# EAGLE design Analog-Mux-Breakout-v11 (EAGLE 6.2)
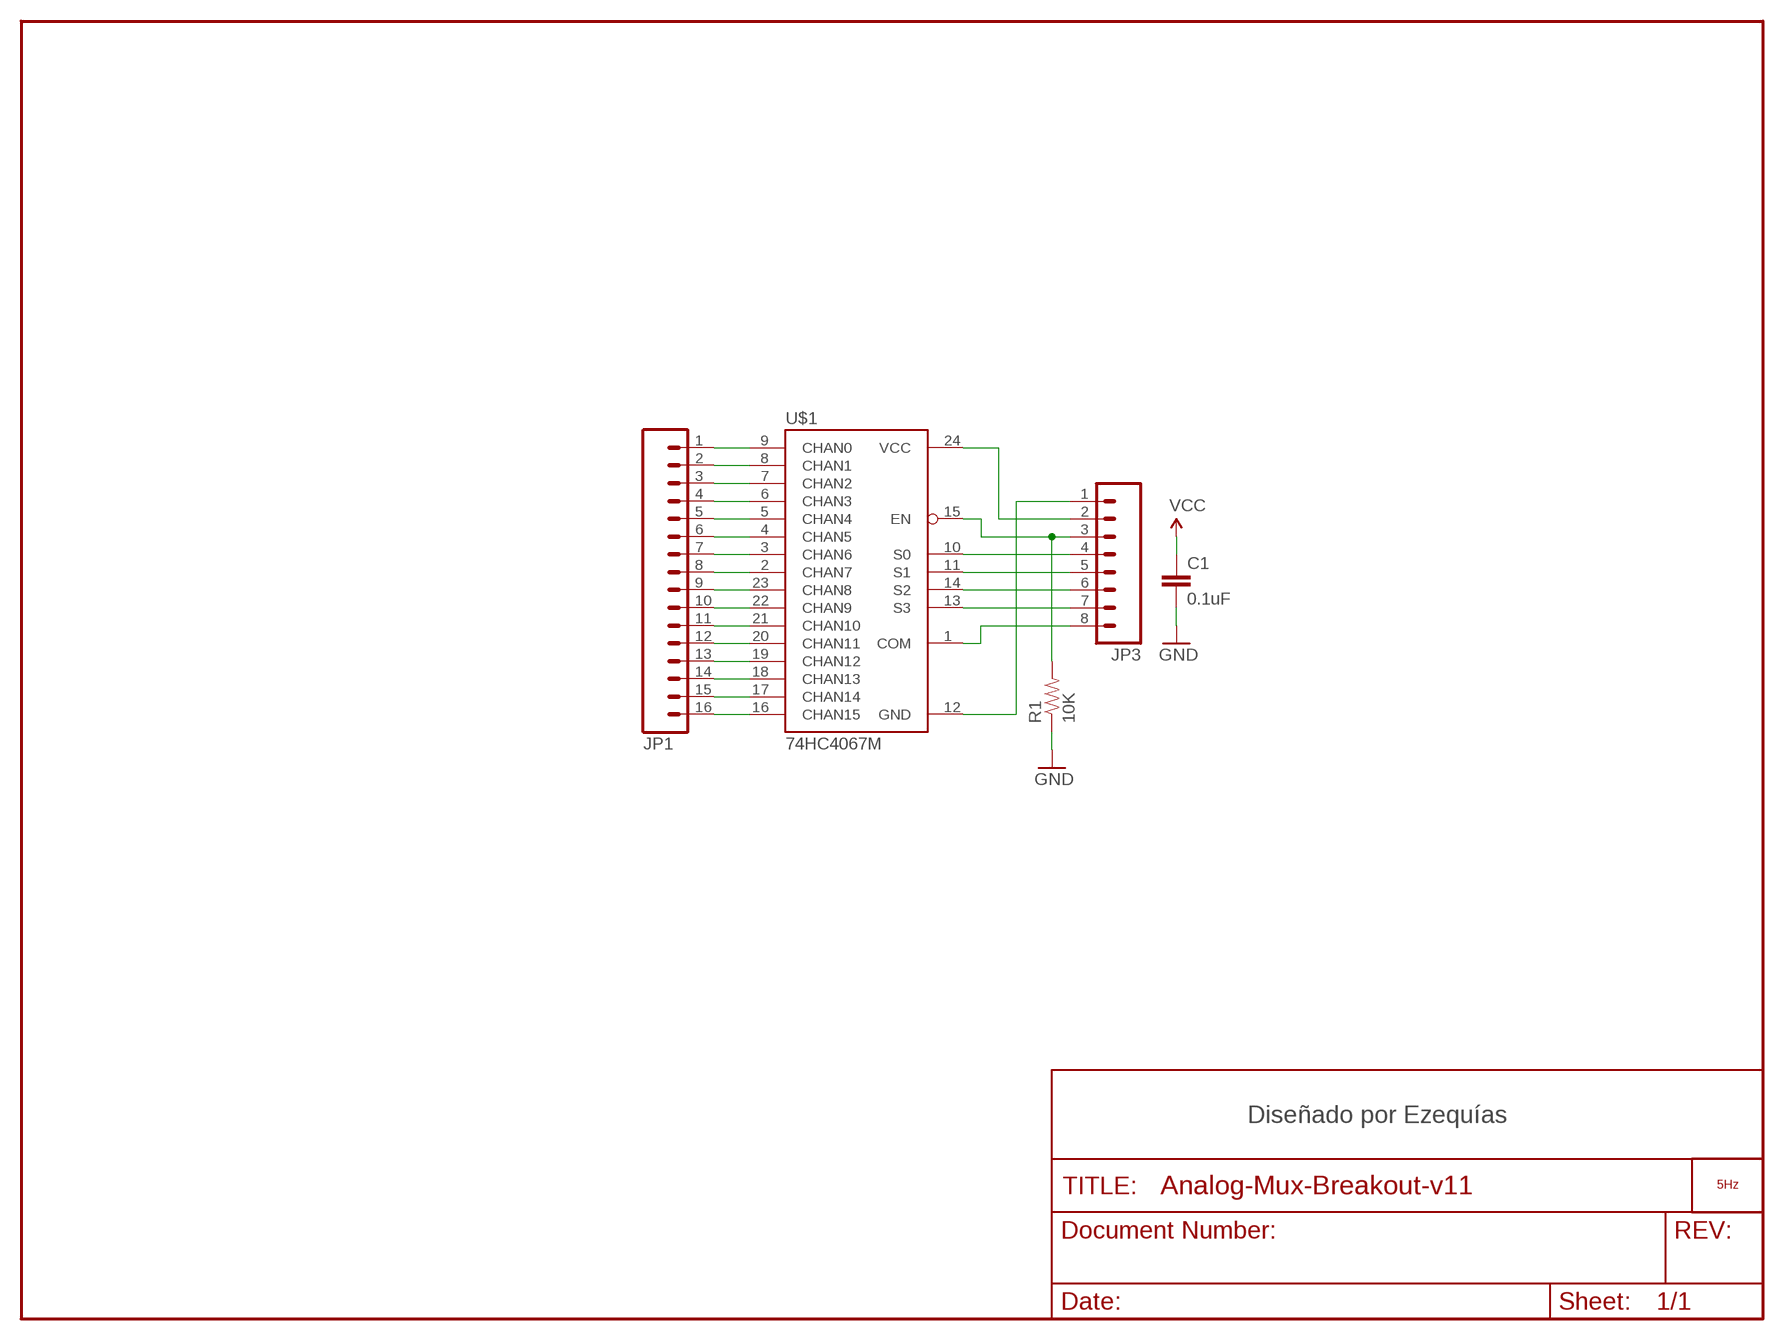
[diagram p0: schematic, sheet 1]

## Parts
C1  0.1uF  CAP0402  [C0402]
JP1  M16PTH  [1X16]
JP3  M08  [1X08]
LOGO1  LOGO_5HZ_H_10MM  [5HZ_LOGO_H_10MM]
R1  10K  RESISTOR0402  [C0402]
U$1  74HC4067M  [SOIC_28]

## Nets
C0: JP1.1 U$1.9(CHAN0)
C1: JP1.2 U$1.8(CHAN1)
C2: JP1.3 U$1.7(CHAN2)
C3: JP1.4 U$1.6(CHAN3)
C4: JP1.5 U$1.5(CHAN4)
C5: JP1.6 U$1.4(CHAN5)
C6: JP1.7 U$1.3(CHAN6)
C7: JP1.8 U$1.2(CHAN7)
C8: JP1.9 U$1.23(CHAN8)
C9: JP1.10 U$1.22(CHAN9)
C10: JP1.11 U$1.21(CHAN10)
C11: JP1.12 U$1.20(CHAN11)
C12: JP1.13 U$1.19(CHAN12)
C13: JP1.14 U$1.18(CHAN13)
C14: JP1.15 U$1.17(CHAN14)
C15: JP1.16 U$1.16(CHAN15)
EN: JP3.3 R1.2 U$1.15(EN)
GND: C1.2 JP3.1 R1.1 U$1.12(GND)
S0: JP3.4 U$1.10(S0)
S1: JP3.5 U$1.11(S1)
S2: JP3.6 U$1.14(S2)
S3: JP3.7 U$1.13(S3)
SIG: JP3.8 U$1.1(COM)
VCC: C1.1 JP3.2 U$1.24(VCC)

## Notes on the sheet
- Diseñado por Ezequías

## Library data of the parts
C1 = SparkFun:CAP: Capacitor Standard 0603 ceramic capacitor, and 0.1" leaded capacitor.
JP1 = SparkFun:M16
JP3 = SparkFun:M08: Header 8 Standard 8-pin 0.1" header. Use with straight break away headers (SKU : PRT-00116), right angle break away headers (PRT-00553), swiss pins (PRT-00743), machine pins (PRT-00117), and female headers (PRT-00115).
LOGO1 = 5hz-electronica:LOGO_5HZ: Logotipo 5Hz "según Pedro"
R1 = SparkFun:RESISTOR: Resistor Basic schematic elements and footprints for 0603, 1206, and PTH 1/10th watt (small) resistors.
U$1 = MAÑE:74HC4067M

## Board
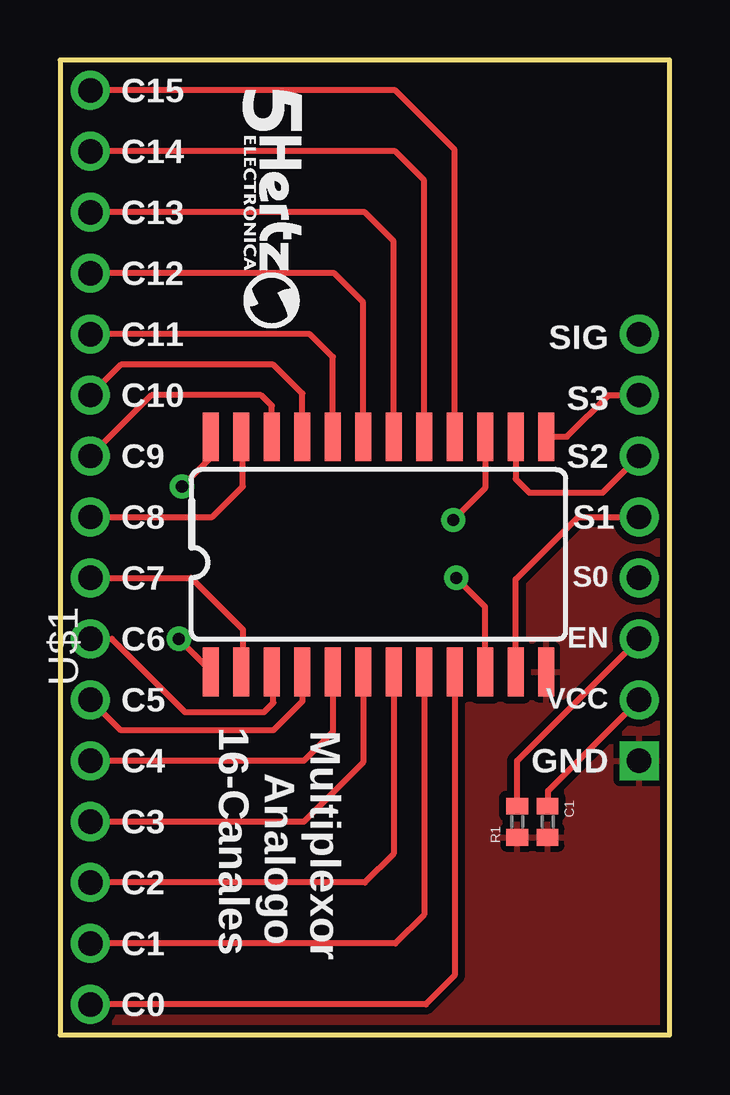
[diagram p1: board, top side]
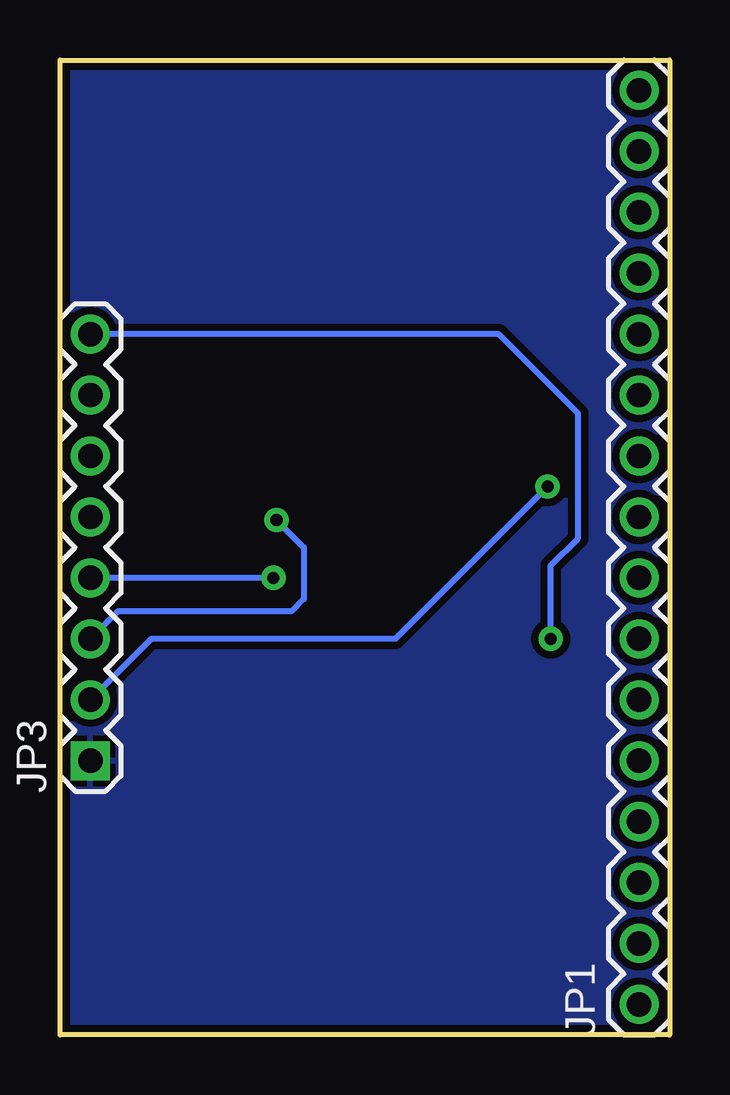
[diagram p2: board, bottom side, seen from below]

Size 25.4 x 40.64 mm. Coordinates in mm from the lower left corner, seen from the top.
Outline: 0,0 25.4,0 25.4,40.64 0,40.64 0,0
Copper layers (1*16): Top 0.035mm / dielectric 1.5mm / Bottom 0.035mm
Design rules: minimum track width 8mil, minimum drill 20mil, track to track 8mil, track to pad 8mil, pad to pad 8mil, via to via 8mil, smd to smd 8mil, copper to edge 10mil, drill to drill 8mil, minimum pad ring 12mil, minimum via ring 10mil, stop-mask expansion 4mil, vias tented up to drill 25mil, thermal gap 10mil

### Footprints (pad centres in the part's own frame; a part is rotated, then mirrored left to right if it is on the bottom)
C0402 = smd 0.7 x 0.9: 1 -0.65,0; 2 0.65,0
1X16 = drill 1.016: 1 0,0; 2 2.54,0; 3 5.08,0; 4 7.62,0; 5 10.16,0; 6 12.7,0; 7 15.24,0; 8 17.78,0; 9 20.32,0; 10 22.86,0; 11 25.4,0; 12 27.94,0; 13 30.48,0; 14 33.02,0; 15 35.56,0; 16 38.1,0
1X08 = drill 1.016 square: 1 0,0 | drill 1.016: 2 2.54,0; 3 5.08,0; 4 7.62,0; 5 10.16,0; 6 12.7,0; 7 15.24,0; 8 17.78,0
SOIC_28 = smd 0.66 x 2.032: 1 -7.685,-3.92; 2 -6.415,-3.92; 3 -5.145,-3.92; 4 -3.875,-3.92; 5 -2.605,-3.92; 6 -1.335,-3.92; 7 -0.065,-3.92; 8 1.205,-3.92; 9 2.475,-3.92; 10 3.745,-3.92; 11 5.015,-3.92; 12 6.285,-3.92; 13 6.285,5.885; 14 5.015,5.885; 15 3.745,5.885; 16 2.475,5.885; 17 1.205,5.885; 18 -0.065,5.885; 19 -1.335,5.885; 20 -2.605,5.885; 21 -3.875,5.885; 22 -5.145,5.885; 23 -6.415,5.885; 24 -7.685,5.885

### Placement (x,y rotation side)
C1  20.32,8.89 270 top
JP1  1.27,1.27 90 bottom
JP3  24.13,11.43 90 bottom
LOGO1  7.62,39.37 270 top
R1  19.05,8.89 90 top
U$1  13.97,19.05 0 top

### Tracks (layer width: path | path; a pad name or v marks a point on that pad's centre or on a via)
C0
  Top 0.254: U$1.9 16.45,2.48 15.24,1.27 JP1.1
C1
  Top 0.254: U$1.8 15.18,5.01 13.97,3.81 JP1.2
C2
  Top 0.254: U$1.7 13.9,7.55 12.7,6.35 JP1.3
C3
  Top 0.254: U$1.6 12.63,11.37 10.16,8.89 JP1.4
C4
  Top 0.254: U$1.5 11.37,12.63 10.16,11.43 JP1.5
C5
  Top 0.254: U$1.4 10.1,13.9 8.89,12.7 2.54,12.7 JP1.6
C6
  Top 0.254: JP1.7 2.16,16.51 5.21,13.46 8.51,13.46 8.89,13.84 8.89,15.06 U$1.3
C7
  Top 0.254: JP1.8 5.46,19.05 7.62,16.89 7.62,15.2 U$1.2
C8
  Top 0.254: JP1.9 6.35,21.59 7.62,22.86 7.62,24.87 U$1.23
C9
  Top 0.254: U$1.22 8.82,26.23 8.38,26.67 3.81,26.67 JP1.10
C10
  Top 0.254: U$1.21 10.1,26.73 8.89,27.94 2.54,27.94 JP1.11
C11
  Top 0.254: U$1.20 11.37,28.26 10.41,29.21 JP1.12
C12
  Top 0.254: U$1.19 12.63,30.55 11.43,31.75 JP1.13
C13
  Top 0.254: U$1.18 13.9,33.09 12.7,34.29 JP1.14
C14
  Top 0.254: U$1.17 15.18,35.62 13.97,36.83 JP1.15
C15
  Top 0.254: U$1.16 16.45,36.9 13.97,39.37 JP1.16
EN  (via drill 0.51)
  Top 0.254: R1.2 19.05,11.43 JP3.3 | U$1.15 17.71,22.8 v16.38,21.46
  Bottom 0.254: v16.38,21.46 15.24,20.32 15.24,18.16 15.75,17.65 22.99,17.65 JP3.3
GND
  pour Bottom (isolate 0.305): 0,0 0,40.64 25.4,40.64 25.4,0
  pour Top (isolate 0.305): 0,0 0,40.64 25.4,40.64 25.4,0
S0  (via drill 0.51)
  Top 0.254: U$1.10 17.71,17.84 v16.51,19.05
  Bottom 0.254: v16.51,19.05 JP3.4
S1
  Top 0.254: U$1.11 18.98,18.98 21.59,21.59 JP3.5
S2
  Top 0.254: U$1.14 18.98,23.18 19.56,22.61 22.61,22.61 JP3.6
S3
  Top 0.254: U$1.13 21.12,24.93 22.86,26.67 JP3.7
SIG  (via drill 0.51)
  Top 0.254: U$1.1 6.29,15.18 v4.95,16.51
  Bottom 0.254: v4.95,16.51 4.95,19.56 3.81,20.7 3.81,25.91 7.11,29.21 JP3.8
VCC  (via drill 0.51)
  Top 0.254: C1.1 20.34,10.18 JP3.2 | U$1.24 6.29,24.07 v5.08,22.86
  Bottom 0.254: v5.08,22.86 11.43,16.51 21.59,16.51 JP3.2

### Text on the board
tPlace: C15 | C14 | C13 | C12 | SIG | C11 | S3 | C10 | S2 | C9 | S1 | C8 | S0 | C7 | EN | C6 | VCC | C5 | 16-Canales | Multiplexor | GND | C4 | Analogo | C3 | C2 | C1 | C0